# EAGLE schematic motion-sensor (EAGLE 7.2.0)
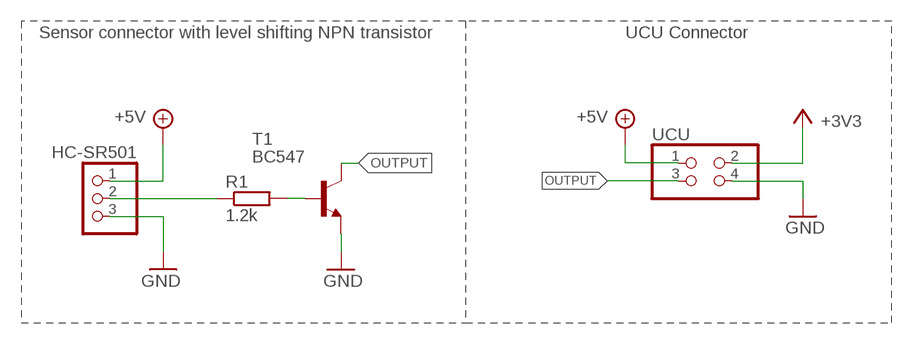
[diagram p0: schematic, sheet 1]

## Parts
HC-SR501  PINHD-1X3  [1X03]
R1  1.2k  R-EU_0204/7  [0204/7]
T1  BC547  [TO92]
UCU  PINHD-2X2  [2X02]

## Nets
+3V3: UCU.2
+5V: HC-SR501.1 UCU.1
GND: HC-SR501.3 T1.1(E) UCU.4
N$1: R1.2 T1.2(B)
N$2: HC-SR501.2 R1.1
OUTPUT: T1.3(C) UCU.3

## Notes on the sheet
- Sensor connector with level shifting NPN transistor | UCU Connector

## Library data of the parts
HC-SR501 = pinhead:PINHD-1X3: PIN HEADER
R1 = resistor:R-EU_: RESISTOR, European symbol
T1 = transistor:BC547: NPN TRANSISTOR
UCU = pinhead:PINHD-2X2: PIN HEADER